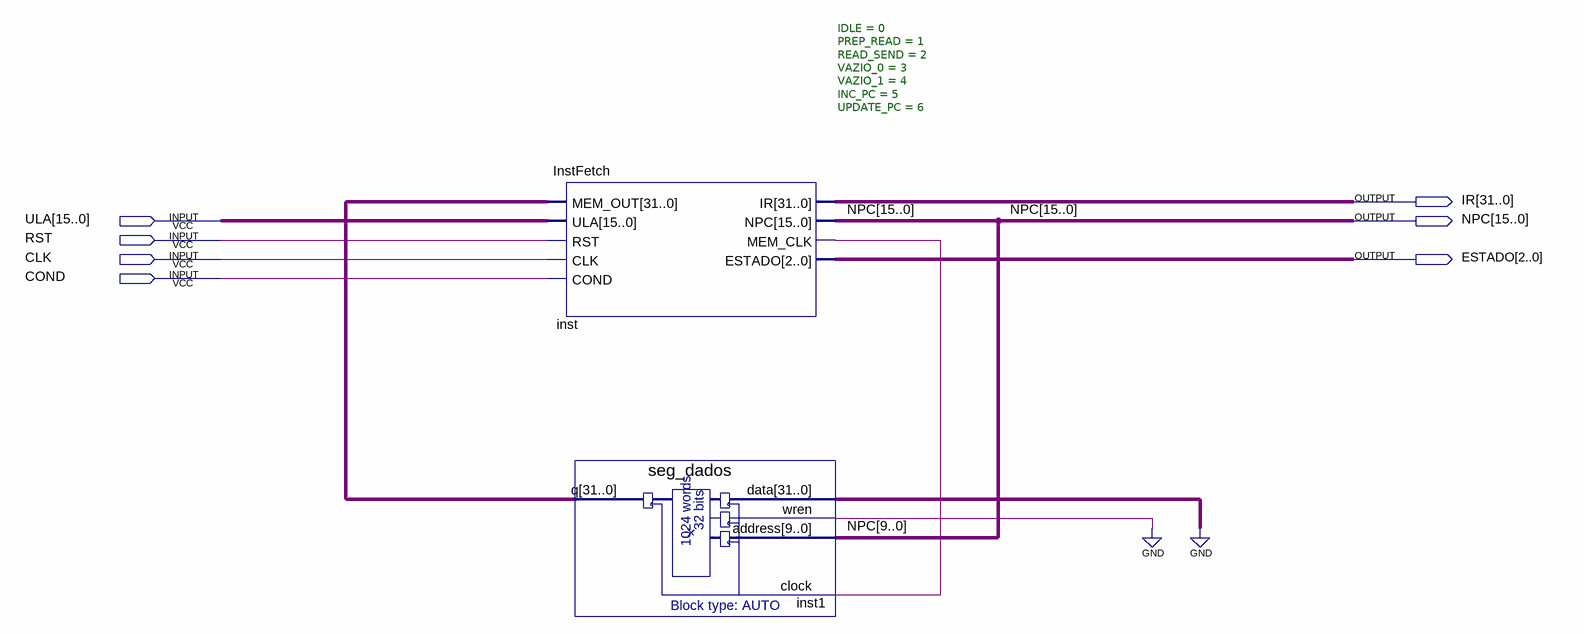
[diagram p0: schematic sheet]
// Quartus schematic InstFetch_block.bdf as structural Verilog: 2 symbols, 7 pins
module InstFetch_block (
  input  [15:0] ULA,
  input  RST,
  input  CLK,
  input  COND,
  output [31:0] IR,
  output [15:0] NPC,
  output [2:0] ESTADO
);

  wire inst_mem_clk;
  wire [31:0] inst1_q;

  InstFetch #(.IDLE(0), .PREP_READ(1), .READ_SEND(2), .VAZIO_0(3), .VAZIO_1(4), .INC_PC(5), .UPDATE_PC(6)) inst (
    .MEM_OUT(inst1_q), .ULA(ULA), .RST(RST), .CLK(CLK), .COND(COND), .IR(IR), .NPC(NPC),
    .MEM_CLK(inst_mem_clk), .ESTADO(ESTADO));
  seg_dados inst1 (.data({32{1'b0}}), .wren(1'b0), .address(NPC[9:0]), .clock(inst_mem_clk), .q(inst1_q));
endmodule
